# Altium schematic sheet ZYNQ400-DDR.SchDoc
size A3
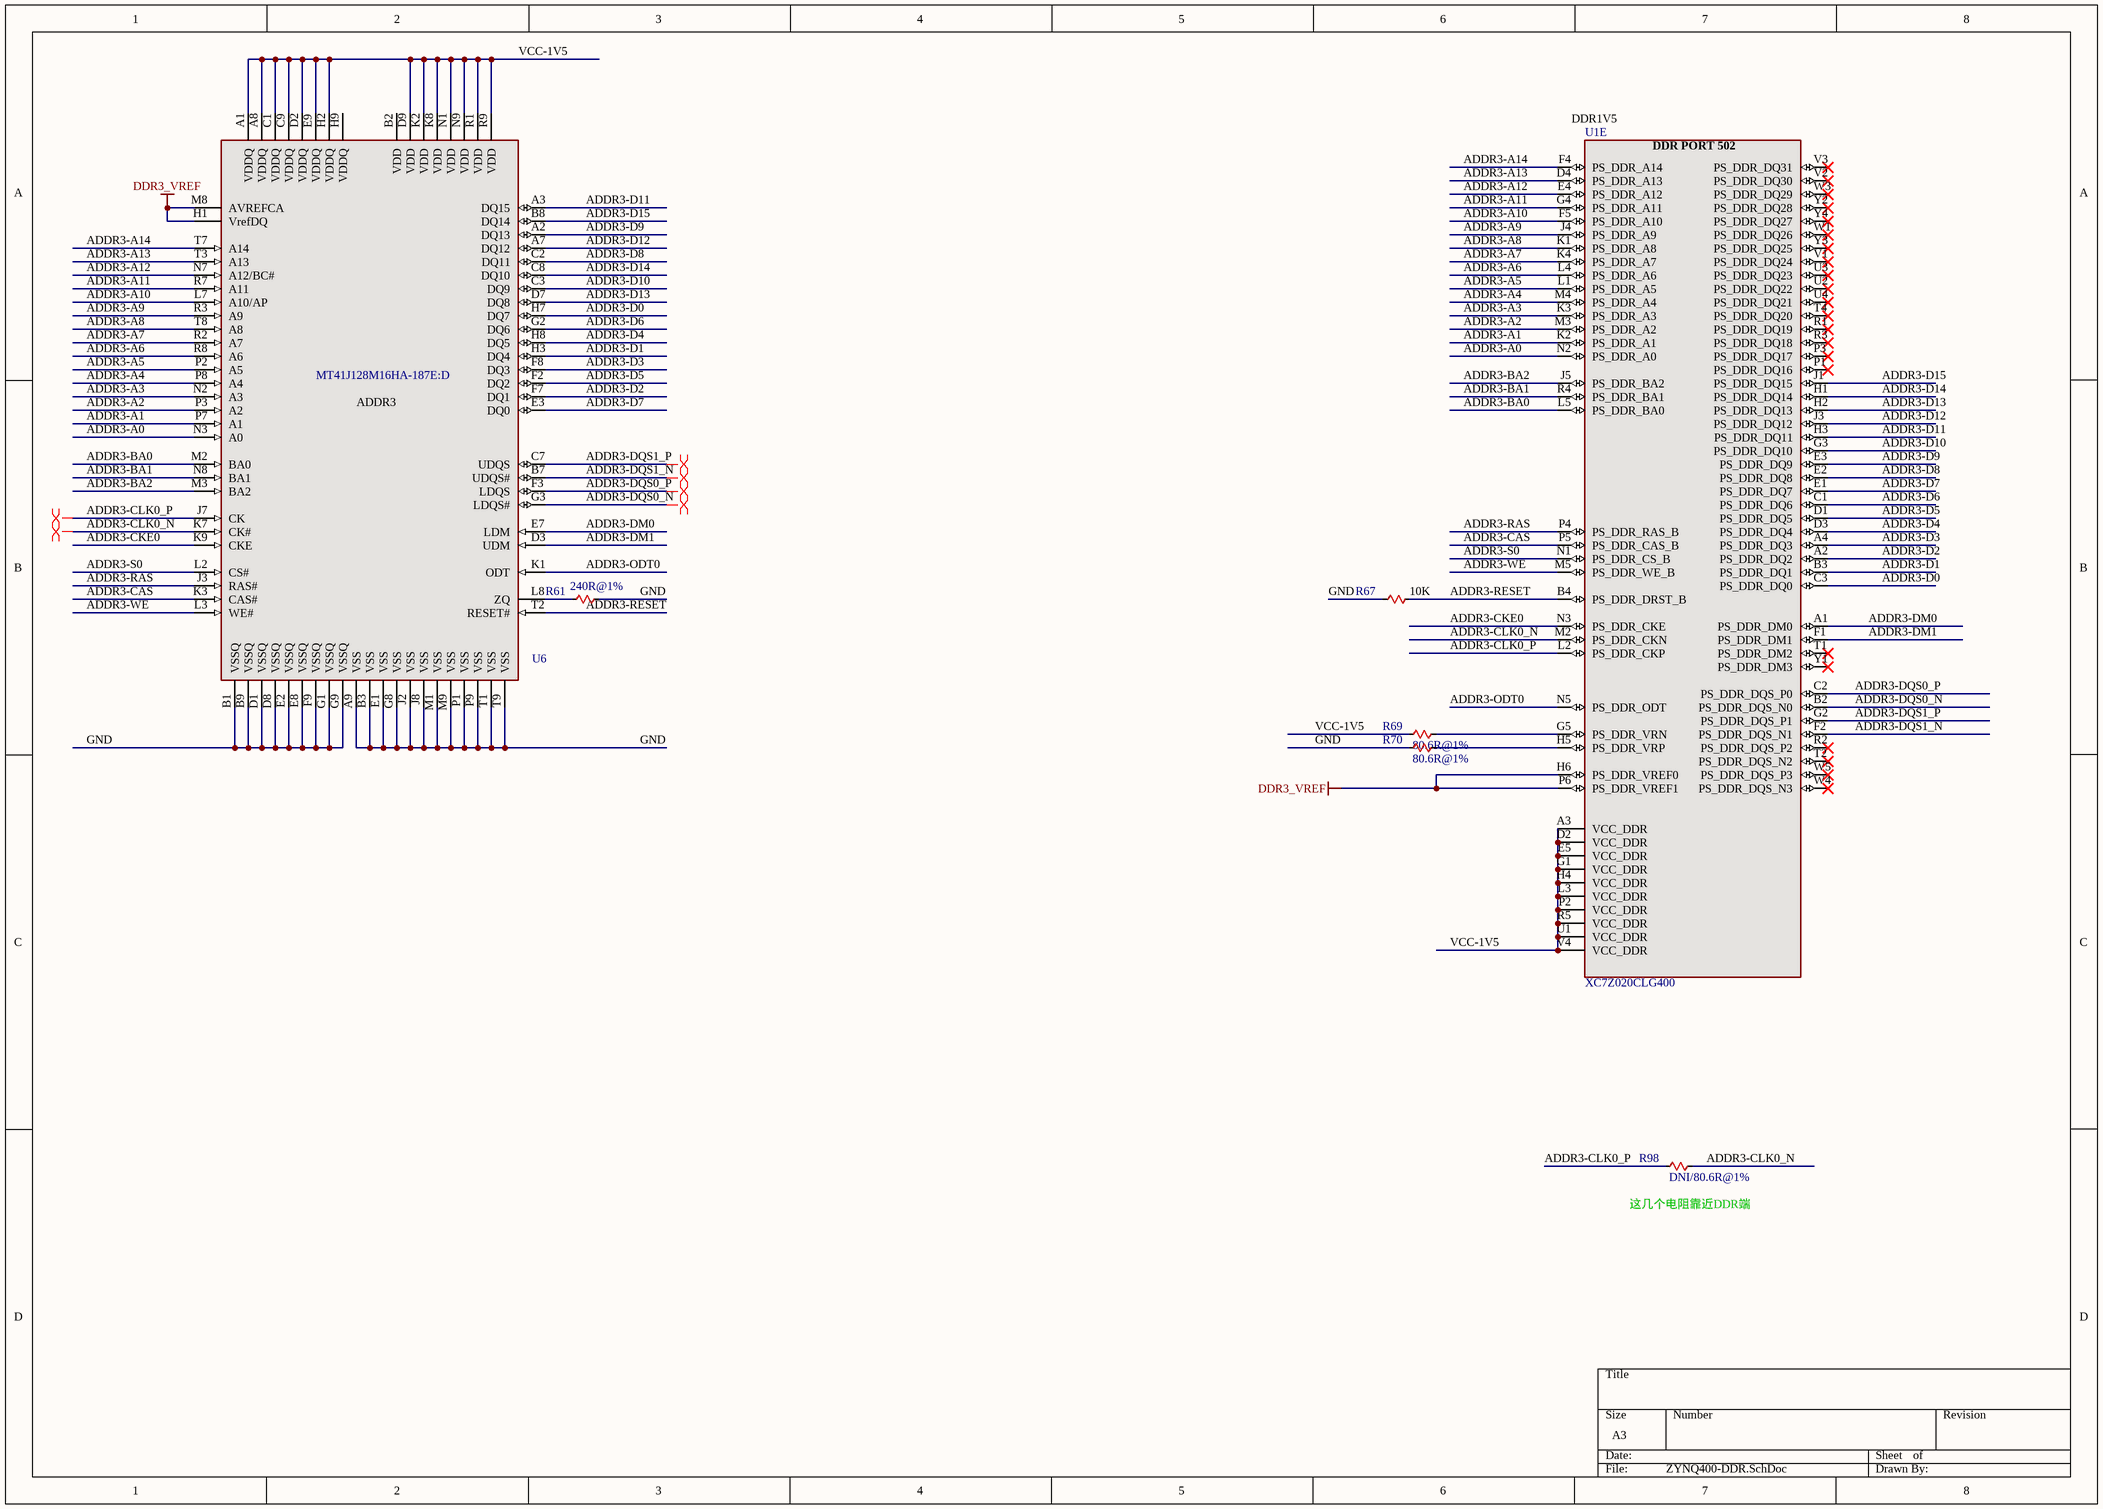
[diagram p0: ZYNQ400-DDR.SchDoc]

## Parts
R61  240R@1%  [0402]
R67  10K  [0402]
R69  80.6R@1%  [0402]
R70  80.6R@1%  [0402]
R98  DNI/80.6R@1%  [0402]
U1  XC7Z020CLG400  [CLG400]  (part E of 9)
U6  MT41J128M16HA-187E:D  [FBGA96]

## Nets
DDR3_VREF: U1.H6(PS_DDR_VREF0) U1.P6(PS_DDR_VREF1) U6.H1(VrefDQ) U6.M8(AVREFCA)
ADDR3-A0: U1.N2(PS_DDR_A0) U6.N3(A0)
ADDR3-A1: U1.K2(PS_DDR_A1) U6.P7(A1)
ADDR3-A2: U1.M3(PS_DDR_A2) U6.P3(A2)
ADDR3-A3: U1.K3(PS_DDR_A3) U6.N2(A3)
ADDR3-A4: U1.M4(PS_DDR_A4) U6.P8(A4)
ADDR3-A5: U1.L1(PS_DDR_A5) U6.P2(A5)
ADDR3-A6: U1.L4(PS_DDR_A6) U6.R8(A6)
ADDR3-A7: U1.K4(PS_DDR_A7) U6.R2(A7)
ADDR3-A8: U1.K1(PS_DDR_A8) U6.T8(A8)
ADDR3-A9: U1.J4(PS_DDR_A9) U6.R3(A9)
ADDR3-A10: U1.F5(PS_DDR_A10) U6.L7(A10/AP)
ADDR3-A11: U1.G4(PS_DDR_A11) U6.R7(A11)
ADDR3-A12: U1.E4(PS_DDR_A12) U6.N7(A12/BC#)
ADDR3-A13: U1.D4(PS_DDR_A13) U6.T3(A13)
ADDR3-A14: U1.F4(PS_DDR_A14) U6.T7(A14)
ADDR3-BA0: U1.L5(PS_DDR_BA0) U6.M2(BA0)
ADDR3-BA1: U1.R4(PS_DDR_BA1) U6.N8(BA1)
ADDR3-BA2: U1.J5(PS_DDR_BA2) U6.M3(BA2)
ADDR3-CAS: U1.P5(PS_DDR_CAS_B) U6.K3(CAS#)
ADDR3-CKE0: U1.N3(PS_DDR_CKE) U6.K9(CKE)
ADDR3-CLK0_N: R98.2 U1.M2(PS_DDR_CKN) U6.K7(CK#)
ADDR3-CLK0_P: R98.1 U1.L2(PS_DDR_CKP) U6.J7(CK)
ADDR3-D0: U1.C3(PS_DDR_DQ0) U6.H7(DQ7)
ADDR3-D1: U1.B3(PS_DDR_DQ1) U6.H3(DQ4)
ADDR3-D2: U1.A2(PS_DDR_DQ2) U6.F7(DQ1)
ADDR3-D3: U1.A4(PS_DDR_DQ3) U6.F8(DQ3)
ADDR3-D4: U1.D3(PS_DDR_DQ4) U6.H8(DQ5)
ADDR3-D5: U1.D1(PS_DDR_DQ5) U6.F2(DQ2)
ADDR3-D6: U1.C1(PS_DDR_DQ6) U6.G2(DQ6)
ADDR3-D7: U1.E1(PS_DDR_DQ7) U6.E3(DQ0)
ADDR3-D8: U1.E2(PS_DDR_DQ8) U6.C2(DQ11)
ADDR3-D9: U1.E3(PS_DDR_DQ9) U6.A2(DQ13)
ADDR3-D10: U1.G3(PS_DDR_DQ10) U6.C3(DQ9)
ADDR3-D11: U1.H3(PS_DDR_DQ11) U6.A3(DQ15)
ADDR3-D12: U1.J3(PS_DDR_DQ12) U6.A7(DQ12)
ADDR3-D13: U1.H2(PS_DDR_DQ13) U6.D7(DQ8)
ADDR3-D14: U1.H1(PS_DDR_DQ14) U6.C8(DQ10)
ADDR3-D15: U1.J1(PS_DDR_DQ15) U6.B8(DQ14)
ADDR3-DM0: U1.A1(PS_DDR_DM0) U6.E7(LDM)
ADDR3-DM1: U1.F1(PS_DDR_DM1) U6.D3(UDM)
ADDR3-DQS0_N: U1.B2(PS_DDR_DQS_N0) U6.G3(LDQS#)
ADDR3-DQS0_P: U1.C2(PS_DDR_DQS_P0) U6.F3(LDQS)
ADDR3-DQS1_N: U1.F2(PS_DDR_DQS_N1) U6.B7(UDQS#)
ADDR3-DQS1_P: U1.G2(PS_DDR_DQS_P1) U6.C7(UDQS)
ADDR3-ODT0: U1.N5(PS_DDR_ODT) U6.K1(ODT)
ADDR3-RAS: U1.P4(PS_DDR_RAS_B) U6.J3(RAS#)
ADDR3-RESET: R67.1 U1.B4(PS_DDR_DRST_B) U6.T2(RESET#)
ADDR3-S0: U1.N1(PS_DDR_CS_B) U6.L2(CS#)
ADDR3-WE: U1.M5(PS_DDR_WE_B) U6.L3(WE#)
GND: R61.2 R67.2 R70.1 U6.A9(VSS) U6.B1(VSSQ) U6.B3(VSS) U6.B9(VSSQ) U6.D1(VSSQ) U6.D8(VSSQ) U6.E1(VSS) U6.E2(VSSQ) U6.E8(VSSQ) U6.F9(VSSQ) U6.G1(VSSQ) U6.G8(VSS) U6.G9(VSSQ) U6.J2(VSS) U6.J8(VSS) U6.M1(VSS) U6.M9(VSS) U6.P1(VSS) U6.P9(VSS) U6.T1(VSS) U6.T9(VSS)
VCC-1V5: R69.1 U1.A3(VCC_DDR) U1.D2(VCC_DDR) U1.E5(VCC_DDR) U1.G1(VCC_DDR) U1.H4(VCC_DDR) U1.L3(VCC_DDR) U1.P2(VCC_DDR) U1.R5(VCC_DDR) U1.U1(VCC_DDR) U1.V4(VCC_DDR) U6.A1(VDDQ) U6.A8(VDDQ) U6.C1(VDDQ) U6.C9(VDDQ) U6.D2(VDDQ) U6.D9(VDD) U6.E9(VDDQ) U6.H2(VDDQ) U6.K2(VDD) U6.K8(VDD) U6.N1(VDD) U6.N9(VDD) U6.R1(VDD) U6.R9(VDD)
NetR61_1: R61.1 U6.L8(ZQ)
NetR69_2: R69.2 U1.G5(PS_DDR_VRN)
NetR70_2: R70.2 U1.H5(PS_DDR_VRP)

Not connected (* = marked no-connect by the designer): U1 P1(PS_DDR_DQ16)* P3(PS_DDR_DQ17)* R1(PS_DDR_DQ19)* R2(PS_DDR_DQS_P2)* R3(PS_DDR_DQ18)* T1(PS_DDR_DM2)* T2(PS_DDR_DQS_N2)* T4(PS_DDR_DQ20)* U2(PS_DDR_DQ22)* U3(PS_DDR_DQ23)* U4(PS_DDR_DQ21)* V1(PS_DDR_DQ24)* V2(PS_DDR_DQ30)* V3(PS_DDR_DQ31)* W1(PS_DDR_DQ26)* W3(PS_DDR_DQ29)* W4(PS_DDR_DQS_N3)* W5(PS_DDR_DQS_P3)* Y1(PS_DDR_DM3)* Y2(PS_DDR_DQ28)* Y3(PS_DDR_DQ25)* Y4(PS_DDR_DQ27)*; U6 B2(VDD) H9(VDDQ)

## Layout directives
differential pair: ADDR3-CLK0_N, ADDR3-CLK0_P, ADDR3-DQS0_N, ADDR3-DQS0_P, ADDR3-DQS1_N, ADDR3-DQS1_P

## Notes on the sheet
- (near U1) DDR1V5
- (near R98) 这几个电阻靠近DDR端
- (in symbol MT41JxxxMxx) ADDR3
- (in symbol XC7Z020-CLG400, part E) DDR PORT 502

## Library data of the parts
R61 = RESISTOR: Generic Resistor; Value: 240R; Manufacturer: *; DPN: *
R67 = RESISTOR: Generic Resistor; Manufacturer: *; DPN: *; Value: 10K
R69 R70 R98 = RESISTOR: Generic Resistor; Value: 80.6R; Manufacturer: *; DPN: *
U1 = XC7Z020-CLG400: Zynq 7000 FPGA 20 Die, in a CSG 484 Package; Manufacturer: Xilinx; DPN: *; Die: *
U6 = MT41JxxxMxx: DDR3 SDRAM 2Gb x4, x8, x16; Manufacturer: Micron; DPN: *